# Altium schematic sheet Stm32.SchDoc
size A4
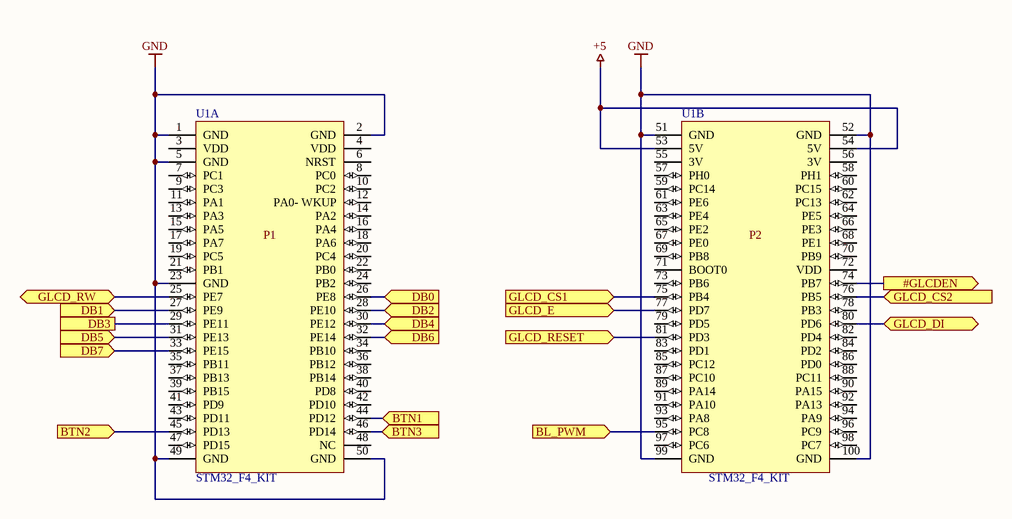
[diagram p0: Stm32.SchDoc]

## Parts
U1  STM32_F4_KIT  [FP_STM32F4DISC]  (parts A,B of 2)

## Ports
#GLCDEN (out), BL_PWM (in), BTN1 (in), BTN2 (in), BTN3 (in), DB0 (in), DB1 (in), DB2 (in), DB3, DB4 (in), DB5 (in), DB6 (in), DB7 (in), GLCD_CS1 (in), GLCD_CS2 (in), GLCD_DI (bidir), GLCD_E (in), GLCD_RESET (in), GLCD_RW (bidir)

## Nets
+5: U1.53(5V) U1.54(5V)
GND: U1.1(GND) U1.2(GND) U1.5(GND) U1.23(GND) U1.49(GND) U1.50(GND) U1.51(GND) U1.52(GND) U1.99(GND) U1.100(GND)
#GLCDEN: U1.74(PB7) ; port #GLCDEN
BL_PWM: U1.95(PC8) ; port BL_PWM
BTN1: U1.44(PD12) ; port BTN1
BTN2: U1.45(PD13) ; port BTN2
BTN3: U1.46(PD14) ; port BTN3
DB0: U1.26(PE8) ; port DB0
DB1: U1.27(PE9) ; port DB1
DB2: U1.28(PE10) ; port DB2
DB3: U1.29(PE11) ; port DB3
DB4: U1.30(PE12) ; port DB4
DB5: U1.31(PE13) ; port DB5
DB6: U1.32(PE14) ; port DB6
DB7: U1.33(PE15) ; port DB7
GLCD_CS1: U1.75(PB4) ; port GLCD_CS1
GLCD_CS2: U1.76(PB5) ; port GLCD_CS2
GLCD_DI: U1.80(PD6) ; port GLCD_DI
GLCD_E: U1.77(PD7) ; port GLCD_E
GLCD_RESET: U1.81(PD3) ; port GLCD_RESET
GLCD_RW: U1.25(PE7) ; port GLCD_RW

Not connected (* = marked no-connect by the designer): U1 3(VDD) 4(VDD) 6(NRST) 7(PC1) 8(PC0) 9(PC3) 10(PC2) 11(PA1) 12(PA0-_WKUP) 13(PA3) 14(PA2) 15(PA5) 16(PA4) 17(PA7) 18(PA6) 19(PC5) 20(PC4) 21(PB1) 22(PB0) 24(PB2) 34(PB10) 35(PB11) 36(PB12) 37(PB13) 38(PB14) 39(PB15) 40(PD8) 41(PD9) 42(PD10) 43(PD11) 47(PD15) 48(NC) 55(3V) 56(3V) 57(PH0) 58(PH1) 59(PC14) 60(PC15) 61(PE6) 62(PC13) 63(PE4) 64(PE5) 65(PE2) 66(PE3) 67(PE0) 68(PE1) 69(PB8) 70(PB9) 71(BOOT0) 72(VDD) 73(PB6) 78(PB3) 79(PD5) 82(PD4) 83(PD1) 84(PD2) 85(PC12) 86(PD0) 87(PC10) 88(PC11) 89(PA14) 90(PA15) 91(PA10) 92(PA13) 93(PA8) 94(PA9) 96(PC9) 97(PC6) 98(PC7)

## Notes on the sheet
- (in symbol STM32F4DISCOVERY, part A) P1
- (in symbol STM32F4DISCOVERY, part B) P2

## Library data of the parts
U1 = STM32F4DISCOVERY: STM32 F4 Discovery Evaluation Kit